# EasyEDA Pro project 割草机MCU.epro

# Schematic Schematic1
Create Date: 2024-04-23; Page Name: P1; Project Name: 飞协; Schematic Name: Schematic1; Update Date: 2024-04-27; Company: 嘉立创EDA; Page Size: A4; Version: V1.0
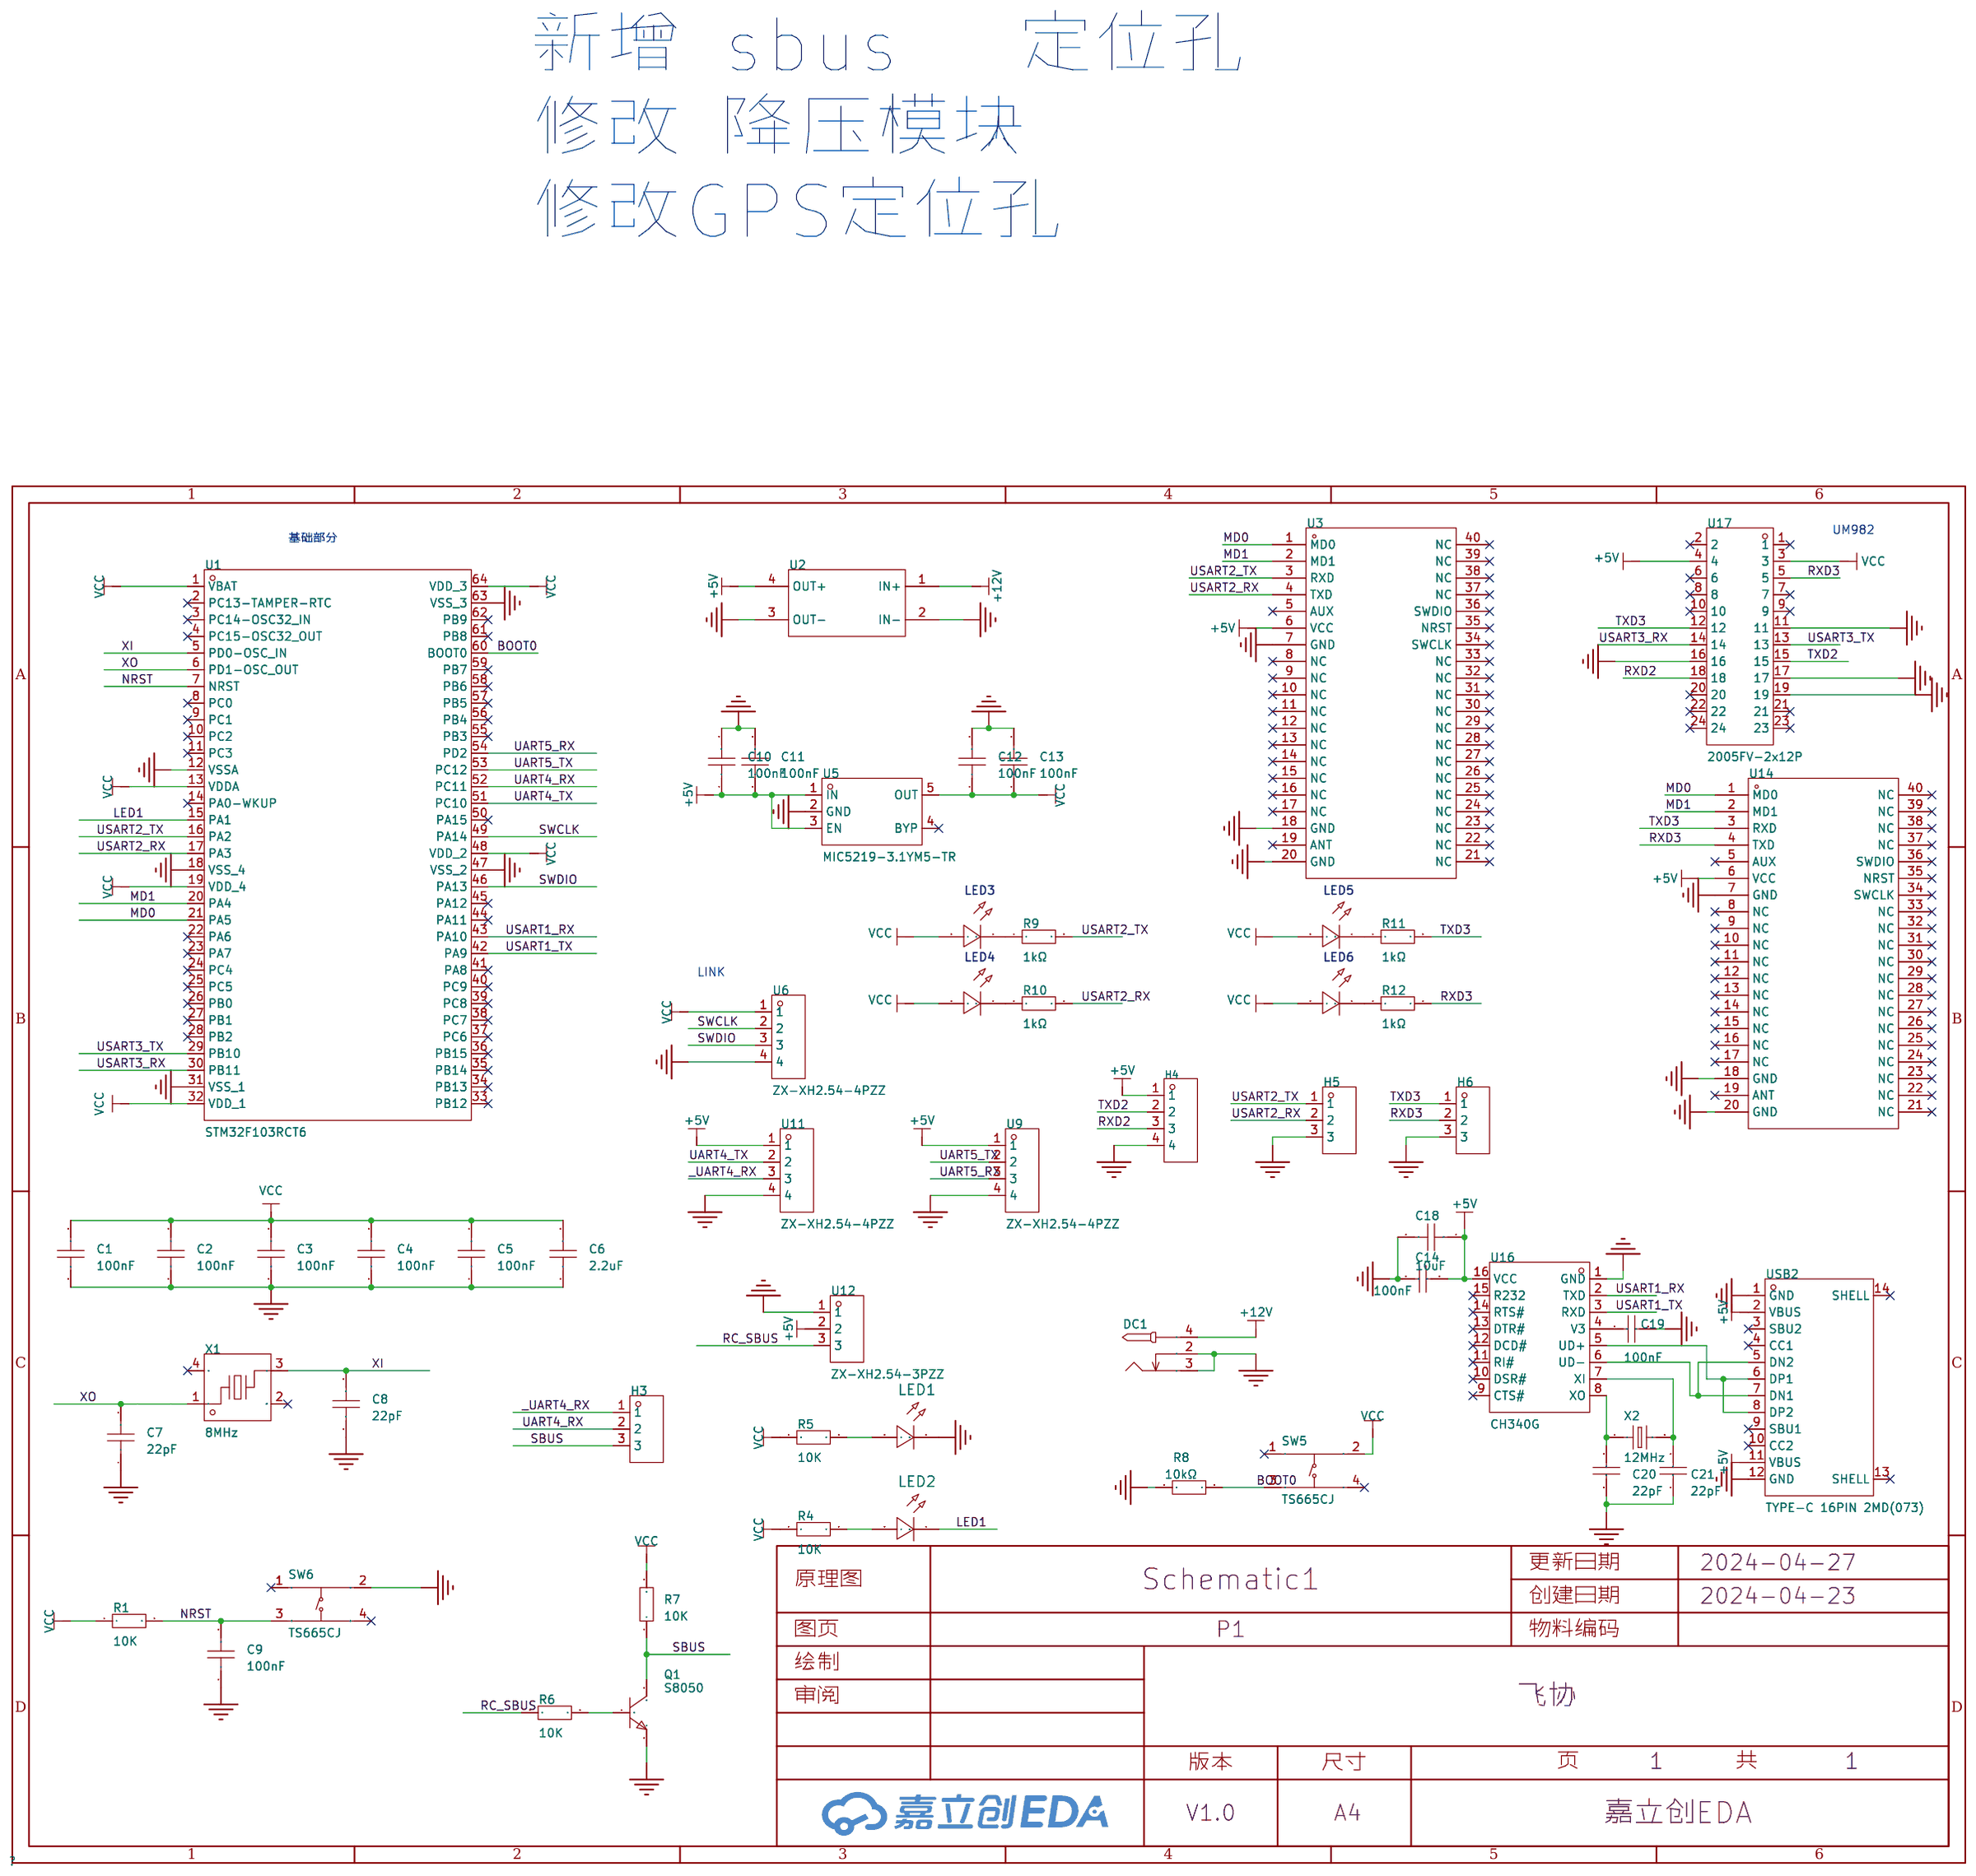
[diagram p0: schematic sheet]

## Parts
C1  100nF  [C0603]
C2  100nF  [C0603]
C3  100nF  [C0603]
C4  100nF  [C0603]
C5  100nF  [C0603]
C6  2.2uF  [C0603]
C7  22pF  [C0603]
C8  22pF  [C0603]
C9  100nF  [C0603]
C10  100nF  [C0603]
C11  100nF  [C0603]
C12  100nF  [C0603]
C13  100nF  [C0603]
C14  100nF  [C0603]
C18  10uF  [C0603]
C19  100nF  [C0603]
C20  22pF  [C0603]
C21  22pF  [C0603]
DC1  -  [DC-2.0]
H3  -  [HDR-TH_3P-P2.54-V-M]
H4  -  [HDR-TH_4P-P2.54-V-M]
H5  -  [HDR-TH_3P-P2.54-V-M]
H6  -  [HDR-TH_3P-P2.54-V-M]
LED1  -  [LED_0603]
LED2  -  [LED_0603]
LED3  -  [LED_0603]
LED4  -  [LED_0603]
LED5  -  [LED_0603]
LED6  -  [LED_0603]
Q1  S8050  [SOT-23-3_L2.9-W1.3-P1.90-LS2.4-BR]
R1  10K  [R0603]
R4  10K  [R0603]
R5  10K  [R0603]
R6  10K  [R0603]
R7  10K  [R0603]
R8  10kΩ  [R0603]
R9  1kΩ  [R0603]
R10  1kΩ  [R0603]
R11  1kΩ  [R0603]
R12  1kΩ  [R0603]
SW5  TS665CJ  [SW-TH_4P-L6.0-W6.0-P4.50-LS6.5]
SW6  TS665CJ  [SW-TH_4P-L6.0-W6.0-P4.50-LS6.5]
U1  STM32F103RCT6  [LQFP-64_L10.0-W10.0-P0.50-LS12.0-BL]
U2  -  [MP2482]
U3  -  [S26-PAD]
U5  MIC5219-3.1YM5-TR  [SOT-23-5_L2.9-W1.6-P0.95-LS2.8-BR]
U6  ZX-XH2.54-4PZZ  [CONN-TH_4P-P2.50_4PIN]
U9  ZX-XH2.54-4PZZ  [CONN-TH_4P-P2.50_4PIN]
U11  ZX-XH2.54-4PZZ  [CONN-TH_4P-P2.50_4PIN]
U12  ZX-XH2.54-3PZZ  [CONN-TH_3P-P2.54_2501S-3P]
U14  -  [S26-PAD]
U16  CH340G  [SOIC-16_L9.9-W3.9-P1.27-LS6.0-BL]
U17  2005FV-2x12P  [HDR-TH_24P-P2.00-V-F-R2-C12-S2.00]
USB2  TYPE-C 16PIN 2MD(073)  [USB-C-SMD_TYPE-C-6PIN-2MD-073]
X1  8MHz  [OSC-SMD_4P-L3.2-W2.5-BL]
X2  12MHz  [HC-49US_L11.5-W4.5-P4.88]

## Library data of the parts
C1-C13 = CAP_0603: Supplier Footprint: 0603
C14 C19 = 0603B104K500NT: 容值:100nF;精度:±10%;额定电压:50V;材质(温度系数):X7R;; LCSC Part Name: 100nF ±10% 50V; Supplier Part: C30926; Manufacturer: FH(风华); Supplier Footprint: 0603; JLCPCB Part Class: 扩展库; Datasheet: https://atta.szlcsc.com/upload/public/pdf/source/20200305/C486355_26A10D38EF8C2A5C37091D0039909270.pdf; Supplier: LCSC; Tolerance: ±10%; Voltage Rated: 50V; Temperature Coefficient: X7R
C18 = CL10A106MA8NRNC: 容值:10uF;精度:±20%;额定电压:25V;材质(温度系数):X5R;; LCSC Part Name: 10uF ±20% 25V; Supplier Part: C96446; Manufacturer: SAMSUNG(三星); Supplier Footprint: 0603; JLCPCB Part Class: 基础库; Datasheet: https://atta.szlcsc.com/upload/public/pdf/source/20160218/1457707763339.pdf; Supplier: LCSC; Tolerance: ±20%; Voltage Rated: 25V; Temperature Coefficient: X5R
C20 C21 = CC0603JRNPO9BN220: 容值:22pF;精度:±5%;额定电压:50V;材质(温度系数):NP0;; LCSC Part Name: 22pF ±5% 50V; Supplier Part: C105620; Manufacturer: YAGEO(国巨); Supplier Footprint: 0603; JLCPCB Part Class: 扩展库; Datasheet: https://atta.szlcsc.com/upload/public/pdf/source/20170505/1493957838062.pdf; Supplier: LCSC; Tolerance: ±5%; Voltage Rated: 50V; Temperature Coefficient: NP0
DC1 = DC-005_2.0: Supplier Footprint: 插件
H3 H5 H6 = HDR-M_2.54_1x3P: Supplier Part: C2937625; Supplier Footprint: 插件
H4 = HDR-M_2.54_1x4P: Supplier Part: C492403; Supplier Footprint: 插件
LED1 LED2 = LED_0603-R: Supplier Footprint: 0603
LED3-LED6 = LED_0603-B: Supplier Footprint: 0603
Q1 = S8050_C2891804: 晶体管类型:NPN;集电极电流(Ic):500mA;集射极击穿电压(Vceo):25V;功率(Pd):300mW;; LCSC Part Name: NPN 电流:500mA 耐压:25V; Supplier Part: C2891804; Manufacturer: YONGYUTAI(永裕泰); Supplier Footprint: SOT-23; JLCPCB Part Class: 扩展库; Datasheet: https://atta.szlcsc.com/upload/public/pdf/source/20210901/5347316A10609C628D4D69AE01446E5B.pdf; Supplier: LCSC; Transistor Type: NPN; Collector Current (Ic): 500mA; Collector-Emitter Breakdown Voltage (Vceo): 25V; Power Dissipation (Pd): 300mW; Collector Cut-Off Current (Icbo): 1uA; Collector-Emitter Saturation Voltage (VCE(sat)@Ic,Ib): 500mV@500mA,50mA
R1 R4-R7 = Res_0603: Supplier Footprint: 0603
R8 = RC0603FR-0710KL: 电阻类型:厚膜电阻;阻值:10kΩ;精度:±1%;功率:100mW;最大工作电压:75V;温度系数:±100ppm/℃;; LCSC Part Name: 厚膜电阻 10kΩ ±1% 100mW; Supplier Part: C98220; Manufacturer: YAGEO(国巨); Supplier Footprint: 0603; JLCPCB Part Class: 扩展库; Datasheet: https://atta.szlcsc.com/upload/public/pdf/source/20180927/C295883_E8D83085EA81BD7DE0B2B681138C15EE.pdf; Supplier: LCSC; Type: 厚膜电阻; Tolerance: ±1%; Power(Watts): 100mW; Overload Voltage (Max): 75V; Temperature Coefficient: ±100ppm/℃; Operating Temperature Range: -55℃~+155℃
R9-R12 = RC0603FR-071KL: 电阻类型:厚膜电阻;阻值:1kΩ;精度:±1%;功率:100mW;; LCSC Part Name: 1kΩ ±1% 100mW; Supplier Part: C22548; Manufacturer: YAGEO(国巨); Supplier Footprint: 0603; JLCPCB Part Class: 扩展库; Datasheet: https://atta.szlcsc.com/upload/public/pdf/source/20180312/7BD3618A8B6324EA6280B0497A051AB7.pdf; Supplier: LCSC; Type: 厚膜电阻; Tolerance: ±1%; Power(Watts): 100mW; Temperature Coefficient: ±100ppm/℃; Overload Voltage (Max): 75V; Operating Temperature Range: -55℃~+155℃
SW5 SW6 = TS665CJ: 电路结构:单刀单掷;按钮形状:圆形按钮;安装方式:直插;开关长度:6mm;开关宽度:6mm;开关高度:5mm;触点电流:50mA;额定电压(DC):12V;带灯:-;机械寿命:-;; LCSC Part Name: 6*6*5mm 直插 轻触开关; Supplier Part: C393938; Manufacturer: SHOU HAN(首韩); Supplier Footprint: 插件; JLCPCB Part Class: 扩展库; Datasheet: https://atta.szlcsc.com/upload/public/pdf/source/20190521/C393938_BDABEAC600B4C55E200A80AA129B70BC.pdf; Supplier: LCSC; Circuit: 单刀单掷; Actuator Style: 圆形按钮; Mounting Style: 直插; Switch Length: 6mm; Switch Width: 6mm; Switch Height: 5mm; Contact Current: 50mA; Voltage Rating (DC): 12V
U1 = STM32F103RCT6: CPU内核:ARM Cortex-M3;CPU最大主频:72MHz;工作电压范围:2V~3.6V;程序存储容量:256KB;程序存储器类型:FLASH;RAM总容量:48KB;GPIO端口数量:51;; Supplier Part: C8323; Manufacturer: ST(意法半导体); Supplier Footprint: LQFP-64(10x10); JLCPCB Part Class: Extended Part; Datasheet: https://atta.szlcsc.com/upload/public/pdf/source/20180207/C88442_15179953708671359491.pdf; Supplier: LCSC; CPU Core: ARM Cortex-M3; CPU Maximum Speed: 72MHz; Operating Voltage Range: 2V~3.6V; Program Storage Size: 256KB; Program Memory Type: FLASH; RAM Size: 48KB; GPIO Ports Number: 51; ADC (Bit): 12bit; DAC (Bit): 12bit; Universal Serial Bus: 有; Peripheral/Function: DMA；片载温度传感器；PWM; Watchdog: 有; Infrared Data Association: 有; Low-Voltage Detect: 有; Direct Memory Access: 有; Internal Oscillator: 有; Operating Temperature Range: -40℃~+85℃
U2 = MP2482: 7-30V--5 V  5A
U3 U14 = S26
U5 = MIC5219-3.1YM5-TR: Supplier Part: C625858; Manufacturer: MICROCHIP(美国微芯); Supplier Footprint: SOT-23-5; JLCPCB Part Class: Extended Part; Datasheet: https://atta.szlcsc.com/upload/public/pdf/source/20220308/DA7E777F7B5E98A0CDCA690AA8ECE812.pdf; Supplier: LCSC
U6 U9 U11 = ZX-XH2.54-4PZZ: 插针结构:1x4P;间距:2.54mm;安装方式:直插;行距:-;总PIN数:4P;排数:1;每排PIN数:4;参考系列:XH;额定电流:3A;触头材质:黄铜;触头镀层:锡;工作温度范围:-25℃~+85℃;; LCSC Part Name: 1x4P 间距:2.54mm 直插 系列:XH; Supplier Part: C7429634; Manufacturer: Megastar(兆星); Supplier Footprint: 插件,P=2.54mm; JLCPCB Part Class: 扩展库; Datasheet: https://atta.szlcsc.com/upload/public/pdf/source/20230619/B529A2163E0159A644AB3383D208FB03.pdf; Supplier: LCSC; Pins Structure: 1x4P; Pitch: 2.54mm; Mounting Style: 直插; Number of Pins: 4P; Number of Rows: 1; Number of PINs Per Row: 4; Reference Series: XH; Current Rating (Max): 3A; Contact Material: 黄铜; Contact Plating: 锡; Operating Temperature Range: -25℃~+85℃
U12 = ZX-XH2.54-3PZZ: 插针结构:1x3P;间距:2.54mm;安装方式:直插;行距:-;总PIN数:3P;排数:1;每排PIN数:3;参考系列:XH;额定电流:3A;触头材质:黄铜;触头镀层:锡;工作温度范围:-25℃~+85℃;; LCSC Part Name: 1x3P 间距:2.54mm 直插 系列:XH; Supplier Part: C7429633; Manufacturer: Megastar(兆星); Supplier Footprint: 插件,P=2.54mm; JLCPCB Part Class: Extended Part; Datasheet: https://atta.szlcsc.com/upload/public/pdf/source/20230619/AE17037A2CFDBE8D9CBA775D61AD0A84.pdf; Supplier: LCSC; Pins Structure: 1x3P; Pitch: 2.54mm; Mounting Style: 直插; Number of Pins: 3P; Number of Rows: 1; Number of PINs Per Row: 3; Reference Series: XH; Current Rating (Max): 3A; Contact Material: 黄铜; Contact Plating: 锡; Operating Temperature Range: -25℃~+85℃
U16 = CH340G: 应用功能:收发器;接口协议:USB 2.0;数据速率:2Mbps;; LCSC Part Name: USB转串口芯片 CH340; Supplier Part: C14267; Manufacturer: WCH(南京沁恒); Supplier Footprint: SOP-16; JLCPCB Part Class: 扩展库; Datasheet: https://atta.szlcsc.com/upload/public/pdf/source/20230530/6E401E9554E9F5311886CC8B3F89B62E.pdf; Supplier: LCSC; Applications Function: 收发器; Protocol: USB 2.0; Supply Voltage: 3.3V；5V; Data Rate: 2Mbps
U17 = 2005FV-2x12P: 插孔结构:2x12P;间距:2mm;行距:2mm;圆孔/方孔:方孔;安装类型:直插;排数:双排;总孔位数:24P;额定电流:2A;插孔方向:顶部;塑高:4.3mm;工作温度范围:-40℃~+105℃;; LCSC Part Name: 间距:2mm 2x12P 直插; Supplier Part: C18722942; Manufacturer: HanElectricity(瀚源); Supplier Footprint: 插件,P=2mm; Datasheet: https://atta.szlcsc.com/upload/public/pdf/source/20231018/9BA4E9C113EE80D3F158358D6D419558.pdf; Supplier: LCSC; Holes Structure: 2x12P; Pitch: 2mm; Row Spacing: 2mm; Circular Hole / Square Hole: 方孔; Mounting Type: 直插; Number of Rows: 双排; Number of Holes: 24P; Current Rating (Max): 2A; Holes Direction: 顶部; Insulation Height: 4.3mm; Operating Temperature Range: -40℃~+105℃
USB2 = TYPE-C 16PIN 2MD(073): 连接器类型:Type-C;标准:-;公母:母;端口数量:1;触点数量:16P;安装方式:卧贴;额定电流 - 电源:5A;工作温度范围:-25℃~+85℃;; LCSC Part Name: Type-C 母 卧贴; Supplier Part: C2765186; Manufacturer: SHOU HAN(首韩); Supplier Footprint: SMD; JLCPCB Part Class: 扩展库; Datasheet: https://atta.szlcsc.com/upload/public/pdf/source/20211123/39B17C16241EAC15C5E277BDA434118E.pdf; Supplier: LCSC; Connector Type: Type-C; Gender: 母; Number of Ports: 1; Number of Contacts: 16P; Mounting Style: 卧贴; Current Rating - Power (Max): 5A; Operating Temperature Range: -25℃~+85℃
X1 = X32258MOB4SI: 晶振类型:贴片无源晶振;频率:8MHz;常温频差:±10ppm;负载电容:12pF;频率稳定度(全温):±30ppm;; LCSC Part Name: 8MHz ±10ppm 12pF; Supplier Part: C2682775; Manufacturer: YXC(扬兴晶振); Supplier Footprint: SMD3225-4P; JLCPCB Part Class: 扩展库; Datasheet: https://atta.szlcsc.com/upload/public/pdf/source/20210106/C2682774_0CD4FDA5D9DA3FBEEC23BD607A48E4B0.pdf; Supplier: LCSC; Crystal Type: 贴片无源晶振; Normal temperature Frequency Tolerance: ±10ppm; Load Capacitance: 12pF; Frequency Stability(Full temperature range): ±30ppm; Equivalent Series Resistance (ESR): 150Ω; Operating Temperature: -40℃~+85℃
X2 = TAXD12M2GLFBET2T: 晶振类型:直插晶振;频率:12MHz;常温频差:±30ppm;外接负载电容:20pF;频率稳定度(全温):±30ppm;; LCSC Part Name: 12MHz ±30ppm 20pF; Supplier Part: C127674; Manufacturer: YJX(雅晶鑫); Supplier Footprint: HC-49S; JLCPCB Part Class: 扩展库; Datasheet: https://atta.szlcsc.com/upload/public/pdf/source/20170914/C127676_1505359415156967690.pdf; Supplier: LCSC; Crystal Type: 直插晶振; Normal temperature Frequency Tolerance: ±30ppm; External load capacitor: 20pF; Frequency Stability(Full temperature range): ±30ppm; Equivalent Series Resistance (ESR): 50Ω; Operating Temperature: -20℃~+70℃

## Nets
+5V: C10.1 C11.1 C14.1 C18.1 H4.1 U2.4(OUT+) U3.6(VCC) U5.1(IN) U5.3(EN) U9.1 U11.1 U12.2 U14.6(VCC) U16.16(VCC) U17.4 USB2.2(VBUS) USB2.11(VBUS)
+12V: DC1.4 U2.1(IN+)
GND: C1.1 C2.1 C3.1 C4.1 C5.1 C6.1 C7.1 C8.1 C9.1 C10.2 C11.2 C12.2 C13.2 C14.2 C18.2 C19.1 C20.1 C21.1 DC1.2 DC1.3 H4.4 H5.3 H6.3 LED1.1(C) Q1.2(E) R8.1 SW6.2(B) U1.12(VSSA) U1.18(VSS_4) U1.31(VSS_1) U1.47(VSS_2) U1.63(VSS_3) U2.2(IN-) U2.3(OUT-) U3.7(GND) U3.18(GND) U3.20(GND) U5.2(GND) U6.4 U9.4 U11.4 U12.1 U14.7(GND) U14.18(GND) U14.20(GND) U16.1(GND) U17.11 U17.16 U17.17 U17.19 USB2.1(GND) USB2.12(GND)
VCC: C1.2 C2.2 C3.2 C4.2 C5.2 C6.2 C12.1 C13.1 LED3.2(A) LED4.2(A) LED5.2(A) LED6.2(A) R1.1 R4.1 R5.1 R7.2 SW5.2(B) U1.1(VBAT) U1.13(VDDA) U1.19(VDD_4) U1.32(VDD_1) U1.48(VDD_2) U1.64(VDD_3) U5.5(OUT) U6.1 U17.3
_UART4_RX: H3.1 U11.3
BOOT0: R8.2 SW5.3(C) U1.60(BOOT0)
LED1: LED2.1(C) U1.15(PA1)
MD0: U1.21(PA5) U3.1(MD0) U14.1(MD0)
MD1: U1.20(PA4) U3.2(MD1) U14.2(MD1)
NRST: C9.2 R1.2 SW6.3(C) U1.7(NRST)
RC_SBUS: R6.1 U12.3
RXD2: H4.3 U17.18
RXD3: H6.2 R12.2 U14.4(TXD) U17.5
SBUS: H3.3 Q1.3(C) R7.1
SWCLK: U1.49(PA14) U6.2
SWDIO: U1.46(PA13) U6.3
TXD2: H4.2 U17.15
TXD3: H6.1 R11.2 U14.3(RXD) U17.12
UART4_RX: H3.2 U1.52(PC11)
UART4_TX: U1.51(PC10) U11.2
UART5_RX: U1.54(PD2) U9.3
UART5_TX: U1.53(PC12) U9.2
USART1_RX: U1.43(PA10) U16.2(TXD)
USART1_TX: U1.42(PA9) U16.3(RXD)
USART2_RX: H5.2 R10.2 U1.17(PA3) U3.4(TXD)
USART2_TX: H5.1 R9.2 U1.16(PA2) U3.3(RXD)
USART3_RX: U1.30(PB11) U17.14
USART3_TX: U1.29(PB10) U17.13
XI: C8.2 U1.5(PD0-OSC_IN) X1.3
XO: C7.2 U1.6(PD1-OSC_OUT) X1.1
$1N8695: LED1.2(A) R5.2
$1N8698: LED2.2(A) R4.2
$1N12056: Q1.1(B) R6.2
$1N22229: U16.6(UD-) USB2.5(DN2) USB2.7(DN1)
$1N22241: U16.5(UD+) USB2.6(DP1) USB2.8(DP2)
$1N24568: C20.2 U16.8(XO) X2.1
$1N24572: C21.2 U16.7(XI) X2.2
$1N29838: C19.2 U16.4(V3)
$1N36299: LED3.1(C) R9.1
$1N36379: LED4.1(C) R10.1
$1N36529: LED5.1(C) R11.1
$1N36536: LED6.1(C) R12.1

Not connected (* = marked no-connect by the designer): SW5 1(A)* 4(D)*; SW6 1(A)* 4(D)*; U1 2(PC13-TAMPER-RTC)* 3(PC14-OSC32_IN)* 4(PC15-OSC32_OUT)* 8(PC0)* 9(PC1)* 10(PC2)* 11(PC3)* 14(PA0-WKUP)* 22(PA6)* 23(PA7)* 24(PC4)* 25(PC5)* 26(PB0)* 27(PB1)* 28(PB2)* 33(PB12)* 34(PB13)* 35(PB14)* 36(PB15)* 37(PC6)* 38(PC7)* 39(PC8)* 40(PC9)* 41(PA8)* 44(PA11)* 45(PA12)* 50(PA15)* 55(PB3)* 56(PB4)* 57(PB5)* 58(PB6)* 59(PB7)* 61(PB8)* 62(PB9)*; U3 5(AUX)* 8(NC)* 9(NC)* 10(NC)* 11(NC)* 12(NC)* 13(NC)* 14(NC)* 15(NC)* 16(NC)* 17(NC)* 19(ANT)* 21(NC)* 22(NC)* 23(NC)* 24(NC)* 25(NC)* 26(NC)* 27(NC)* 28(NC)* 29(NC)* 30(NC)* 31(NC)* 32(NC)* 33(NC)* 34(SWCLK)* 35(NRST)* 36(SWDIO)* 37(NC)* 38(NC)* 39(NC)* 40(NC)*; U5 4(BYP)*; U14 5(AUX)* 8(NC)* 9(NC)* 10(NC)* 11(NC)* 12(NC)* 13(NC)* 14(NC)* 15(NC)* 16(NC)* 17(NC)* 19(ANT)* 21(NC)* 22(NC)* 23(NC)* 24(NC)* 25(NC)* 26(NC)* 27(NC)* 28(NC)* 29(NC)* 30(NC)* 31(NC)* 32(NC)* 33(NC)* 34(SWCLK)* 35(NRST)* 36(SWDIO)* 37(NC)* 38(NC)* 39(NC)* 40(NC)*; U16 9(CTS#)* 10(DSR#)* 11(RI#)* 12(DCD#)* 13(DTR#)* 14(RTS#)* 15(R232)*; U17 1* 2* 6* 7* 8* 9* 10* 20* 21* 22* 23* 24*; USB2 3(SBU2)* 4(CC1)* 9(SBU1)* 10(CC2)* 13(SHELL)* 14(SHELL)*; X1 2(GND)* 4(GND)*

## Notes on the sheet
- 新增 sbus   定位孔
  修改 降压模块
  修改GPS定位孔
- 基础部分
- UM982
- LINK

# Board PCB1
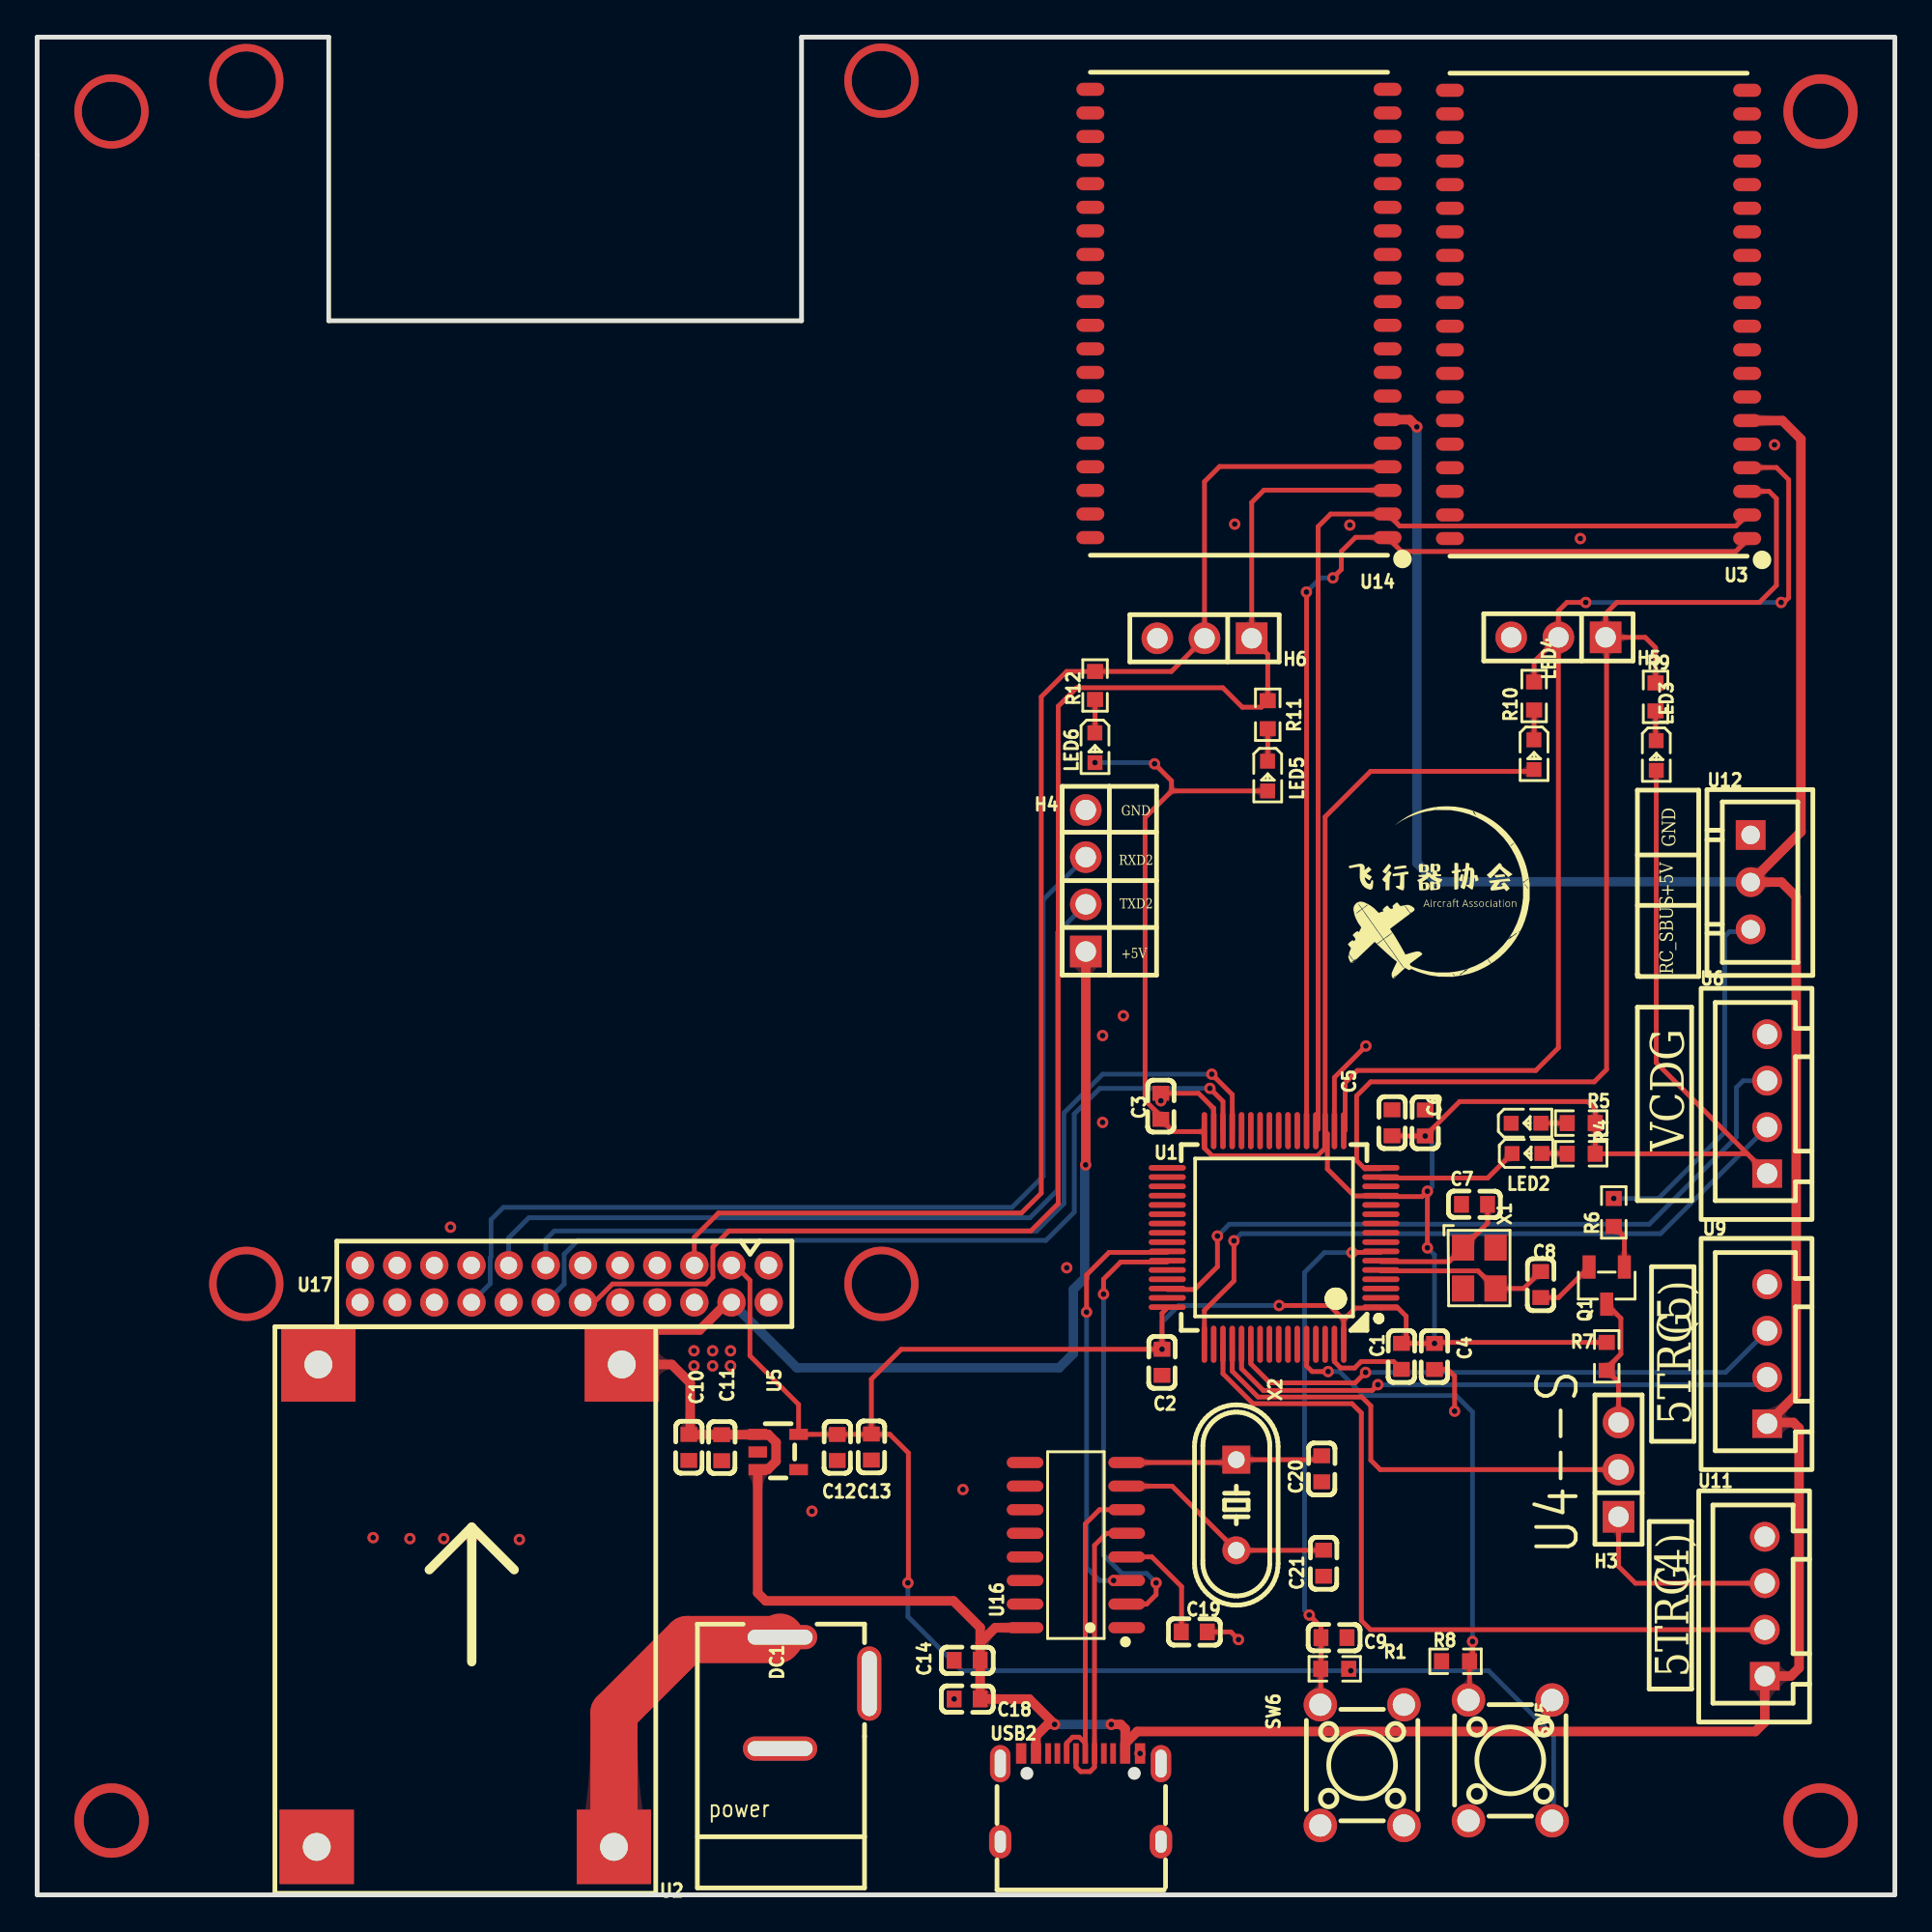
[diagram p1: board, top side]
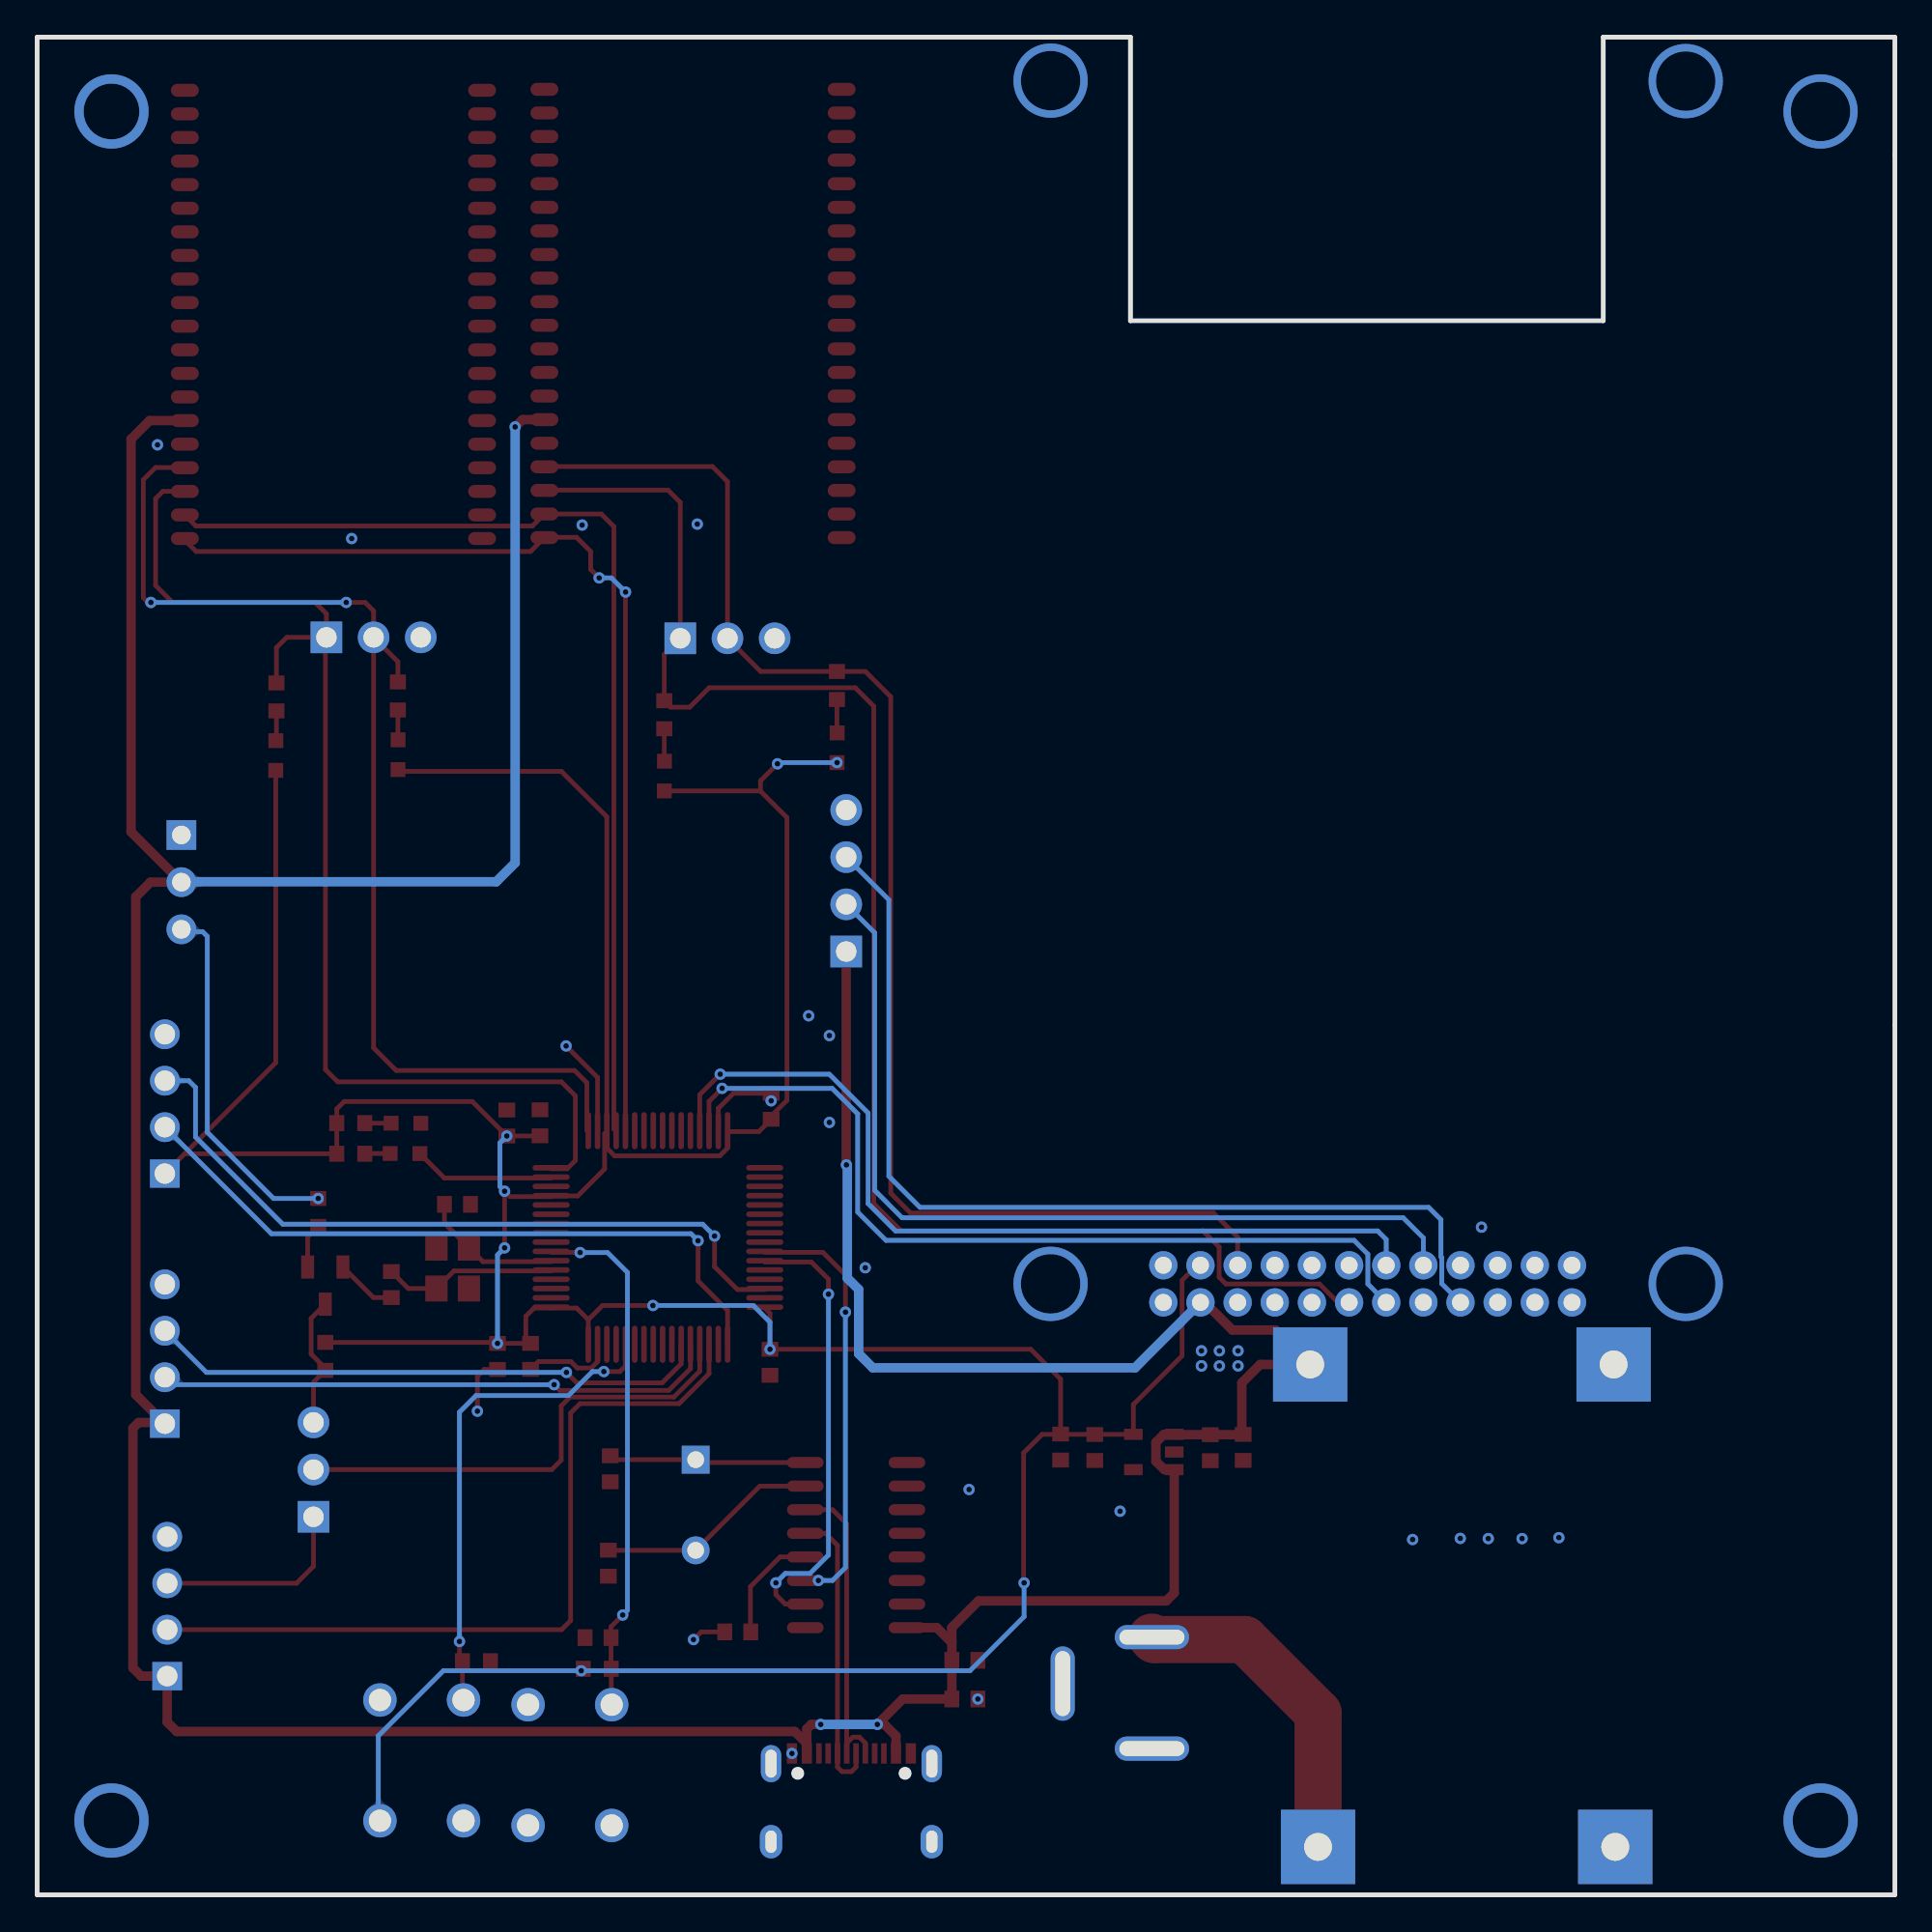
[diagram p2: board, bottom side, seen from below]

Outline 100 x 100 mm; copper layers: Top Layer, Bottom Layer. Coordinates in mm from the lower left corner of the outline.
Outline path: 0,100 15.7,100 15.7,84.73 41.15,84.73 41.15,100 100,100 100,0 0,0 0,100
Stack: Top Layer 0.035mm / Dielectric1 1.51mm FR4 er 4.5 / Bottom Layer 0.035mm

## Design rules (mm)
template: 自定义配置
spacing copperThickness1oz (default): track to track 0.102, other pairs 0.102 to 0.3
spacing copperThickness2oz: track to track 0.203, other pairs 0.152 to 0.3
track width copperThickness1oz (default): min 0.127, default 0.254, max 2.54
track width copperThickness2oz: min 0.203, default 0.254, max 2.54
differential pair differentialPair (default): width min 0.127, default 0.254, max 2.54; gap min 0.152, default 0.152
via viaSize (default): diameter min 0.5, default 0.61, max 10; hole min 0.3, default 0.305, max 6.299

## Placement (name value [footprint] x y rotation side)
C1  100nF  [C0603]  73.44 28.99 90 top
C2  100nF  [C0603]  60.55 28.67 90 top
C3  100nF  [C0603]  60.49 42.45 270 top
C4  100nF  [C0603]  75.22 28.98 90 top
C5  100nF  [C0603]  72.93 41.56 270 top
C6  2.2uF  [C0603]  74.72 41.55 270 top
C7  22pF  [C0603]  77.38 37.17 0 top
C8  22pF  [C0603]  80.93 32.85 90 top
C9  100nF  [C0603]  69.81 13.85 180 top
C10  100nF  [C0603]  35.08 24.09 270 top
C11  100nF  [C0603]  36.85 24.07 270 top
C12  100nF  [C0603]  43.07 24.08 270 top
C13  100nF  [C0603]  44.91 24.1 270 top
C14  100nF  [C0603]  50.06 12.62 180 top
C18  10uF  [C0603]  50.06 10.54 180 top
C19  100nF  [C0603]  62.29 14.15 180 top
C20  22pF  [C0603]  69.15 22.93 90 top
C21  22pF  [C0603]  69.25 17.85 90 top
DC1  -  [DC-2.0]  39.73 10.74 270 top
H3  -  [HDR-TH_3P-P2.54-V-M]  85.12 22.89 90 top
H4  -  [HDR-TH_4P-P2.54-V-M]  56.45 54.59 90 top
H5  -  [HDR-TH_3P-P2.54-V-M]  81.89 67.69 180 top
H6  -  [HDR-TH_3P-P2.54-V-M]  62.84 67.64 180 top
LED1  -  [LED_0603]  80.2 41.54 0 top
LED2  -  [LED_0603]  80.25 39.91 0 top
LED3  -  [LED_0603]  87.16 61.28 270 top
LED4  -  [LED_0603]  80.58 61.32 270 top
LED5  -  [LED_0603]  66.24 60.17 270 top
LED6  -  [LED_0603]  56.95 61.7 270 top
Q1  S8050  [SOT-23-3_L2.9-W1.3-P1.90-LS2.4-BR]  84.49 32.8 90 top
R1  10K  [R0603]  69.85 12.17 180 top
R4  10K  [R0603]  83.12 39.89 180 top
R5  10K  [R0603]  83.12 41.54 180 top
R6  10K  [R0603]  84.87 36.73 270 top
R7  10K  [R0603]  84.49 28.99 90 top
R8  10kΩ  [R0603]  76.35 12.57 0 top
R9  1kΩ  [R0603]  87.12 64.48 90 top
R10  1kΩ  [R0603]  80.58 64.53 90 top
R11  1kΩ  [R0603]  66.24 63.53 90 top
R12  1kΩ  [R0603]  56.95 65.1 90 top
SW5  TS665CJ  [SW-TH_4P-L6.0-W6.0-P4.50-LS6.5]  79.3 7.24 270 top
SW6  TS665CJ  [SW-TH_4P-L6.0-W6.0-P4.50-LS6.5]  71.32 6.99 270 top
U1  STM32F103RCT6  [LQFP-64_L10.0-W10.0-P0.50-LS12.0-BL]  66.58 35.39 90 top
U2  -  [MP2482]  33.38 30.71 180 top
U3  -  [S26-PAD]  92.05 72.06 90 top
U5  MIC5219-3.1YM5-TR  [SOT-23-5_L2.9-W1.6-P0.95-LS2.8-BR]  39.89 23.84 180 top
U6  ZX-XH2.54-4PZZ  [CONN-TH_4P-P2.50_4PIN]  93.13 42.58 90 top
U9  ZX-XH2.54-4PZZ  [CONN-TH_4P-P2.50_4PIN]  93.13 29.11 90 top
U11  ZX-XH2.54-4PZZ  [CONN-TH_4P-P2.50_4PIN]  93 15.52 90 top
U12  ZX-XH2.54-3PZZ  [CONN-TH_3P-P2.54_2501S-3P]  92.24 54.51 270 top
U14  -  [S26-PAD]  72.69 72.11 90 top
U16  CH340G  [SOIC-16_L9.9-W3.9-P1.27-LS6.0-BL]  55.91 18.83 90 top
U17  2005FV-2x12P  [HDR-TH_24P-P2.00-V-F-R2-C12-S2.00]  28.38 32.89 180 top
USB2  TYPE-C 16PIN 2MD(073)  [USB-C-SMD_TYPE-C-6PIN-2MD-073]  56.17 5.24 0 top
X1  8MHz  [OSC-SMD_4P-L3.2-W2.5-BL]  77.63 33.74 270 top
X2  12MHz  [HC-49US_L11.5-W4.5-P4.88]  64.55 20.99 270 top

## Footprints (pads in the part's own frame, mm; a bottom-side part is the same pattern mirrored in y, then rotated)
C0603
  rect 0.8x0.9 smd: 1(-0.7,0) 2(0.7,0)
CONN-TH_3P-P2.54_2501S-3P
  rect 1.6x1.6 hole 1: 1(-2.54,0)
  round 1.6 hole 1: 2(0,0) 3(2.54,0)
CONN-TH_4P-P2.50_4PIN
  rect 1.524x1.6 hole 1.1: 1(-3.75,0)
  round 1.6 hole 1.1: 2(-1.25,0) 3(1.25,0) 4(3.75,0)
DC-2.0
  oval 4x1.3 hole 3.5x0.8: 2(-0.627,5.067)
  oval 1.3x4 hole 0.8x3.5: 3(2.873,0.267) 4(-3.127,0.267)
HC-49US_L11.5-W4.5-P4.88
  rect 1.5x1.5 hole 0.9: 1(-2.44,0)
  round 1.5 hole 0.9: 2(2.44,0)
HDR-TH_3P-P2.54-V-M
  rect 1.7x1.7 hole 1.1: 1(-2.54,0)
  round 1.7 hole 1.1: 2(0,0) 3(2.54,0)
HDR-TH_4P-P2.54-V-M
  rect 1.7x1.7 hole 1.1: 1(-3.81,0)
  round 1.7 hole 1.1: 2(-1.27,0) 3(1.27,0) 4(3.81,0)
HDR-TH_24P-P2.00-V-F-R2-C12-S2.00
  round 1.524 hole 0.914: 1(-10.999,-1.001) 2(-10.999,0.998) 3(-9.001,-1.001) 4(-9.001,0.998) 5(-6.999,-1.001) 6(-6.999,0.998) 7(-5,-1.001) 8(-5,0.998) 9(-3.001,-1.001) 10(-3.001,1.001) 11(-1,-1.001) 12(-1,0.998) 13(1,-1.001) 14(1,0.998) 15(2.998,-1.001) 16(2.998,0.998) 17(4.997,-1.001) 18(4.997,0.998) 19(6.999,-1.001) 20(6.999,0.998) 21(9.001,-1.001) 22(8.998,0.998) 23(10.999,-1.001) 24(10.999,0.998)
LED_0603
  rect 0.8x0.8 smd: 1(-0.851,-0.01) 2(0.75,-0.005)
LQFP-64_L10.0-W10.0-P0.50-LS12.0-BL
  oval 0.3x2 smd: 1(-3.75,-5.75) 2(-3.25,-5.75) 3(-2.75,-5.75) 4(-2.25,-5.75) 5(-1.75,-5.75) 6(-1.25,-5.75) 7(-0.75,-5.75) 8(-0.25,-5.75) 9(0.25,-5.75) 10(0.75,-5.75) 11(1.25,-5.75) 12(1.75,-5.75) 13(2.25,-5.75) 14(2.75,-5.75) 15(3.25,-5.75) 16(3.75,-5.75) 33(3.75,5.75) 34(3.25,5.75) 35(2.75,5.75) 36(2.25,5.75) 37(1.75,5.75) 38(1.25,5.75) 39(0.75,5.75) 40(0.25,5.75) 41(-0.25,5.75) 42(-0.75,5.75) 43(-1.25,5.75) 44(-1.75,5.75) 45(-2.25,5.75) 46(-2.75,5.75) 47(-3.25,5.75) 48(-3.75,5.75)
  oval 2x0.3 smd: 17(5.75,-3.75) 18(5.75,-3.25) 19(5.75,-2.75) 20(5.75,-2.25) 21(5.75,-1.75) 22(5.75,-1.25) 23(5.75,-0.75) 24(5.75,-0.25) 25(5.75,0.25) 26(5.75,0.75) 27(5.75,1.25) 28(5.75,1.75) 29(5.75,2.25) 30(5.75,2.75) 31(5.75,3.25) 32(5.75,3.75) 49(-5.75,3.75) 50(-5.75,3.25) 51(-5.75,2.75) 52(-5.75,2.25) 53(-5.75,1.75) 54(-5.75,1.25) 55(-5.75,0.75) 56(-5.75,0.25) 57(-5.75,-0.25) 58(-5.75,-0.75) 59(-5.75,-1.25) 60(-5.75,-1.75) 61(-5.75,-2.25) 62(-5.75,-2.75) 63(-5.75,-3.25) 64(-5.75,-3.75)
MP2482
  rect 4x4 hole 1.5: 1(2.326,28.127) 2(18.326,28.127) 3(18.238,2.159) 4(1.905,2.159)
OSC-SMD_4P-L3.2-W2.5-BL
  rect 1.4x1.2 smd: 1(-1.1,-0.875) 2(1.1,-0.875) 3(1.1,0.875) 4(-1.1,0.875)
R0603
  rect 0.806x0.864 smd: 1(-0.753,0) 2(0.753,0)
S26-PAD
  oval 0.7x1.5 smd: 1(0.95,0) 2(2.22,0) 3(3.49,0) 4(4.76,0) 5(6.03,0) 6(7.3,0) 7(8.57,0) 8(9.84,0) 9(11.11,0) 10(12.38,0) 11(13.65,0) 12(14.92,0) 13(16.19,0) 14(17.46,0) 15(18.73,0) 16(20,0) 17(21.27,0) 18(22.54,0) 19(23.81,0) 20(25.08,0) 21(25.08,16) 22(23.81,16) 23(22.54,16) 24(21.27,16) 25(20,16) 26(18.73,16) 27(17.46,16) 28(16.19,16) 29(14.92,16) 30(13.65,16) 31(12.38,16) 32(11.11,16) 33(9.84,16) 34(8.57,16) 35(7.3,16) 36(6.03,16) 37(4.76,16) 38(3.49,16) 39(2.22,16) 40(0.95,16)
SOIC-16_L9.9-W3.9-P1.27-LS6.0-BL
  oval 0.602x1.971 smd: 1(-4.445,-2.736) 2(-3.175,-2.736) 3(-1.905,-2.736) 4(-0.635,-2.736) 5(0.635,-2.736) 6(1.905,-2.736) 7(3.175,-2.736) 8(4.445,-2.736) 9(4.445,2.736) 10(3.175,2.736) 11(1.905,2.736) 12(0.635,2.736) 13(-0.635,2.736) 14(-1.905,2.736) 15(-3.175,2.736) 16(-4.445,2.736)
SOT-23-3_L2.9-W1.3-P1.90-LS2.4-BR
  rect 1.25x0.7 smd: 1(1,-0.95) 2(1,0.95) 3(-1,0)
SOT-23-5_L2.9-W1.6-P0.95-LS2.8-BR
  rect 1x0.6 smd: 1(1.1,-0.95) 2(1.1,0) 3(1.1,0.95) 4(-1.1,0.95) 5(-1.1,-0.95)
SW-TH_4P-L6.0-W6.0-P4.50-LS6.5
  round 1.8 hole 1.2: 1(-3.25,2.25) 2(3.25,2.25) 3(-3.25,-2.25) 4(3.25,-2.25)
USB-C-SMD_TYPE-C-6PIN-2MD-073
  rect 0.55x1.1 smd: 1(-3.2,2.375) 2(-2.4,2.375) 11(2.4,2.375) 12(3.2,2.375)
  rect 0.3x1.1 smd: 3(-1.75,2.375) 4(-1.25,2.375) 5(-0.75,2.375) 6(-0.25,2.375) 7(0.25,2.375) 8(0.75,2.375) 9(1.25,2.375) 10(1.75,2.375)
  oval 1.1x2 hole 0.6x1.5: 13(-4.325,1.825) 14(4.325,1.825)
  oval 1.2x1.8 hole 0.6x1.2: 13(-4.325,-2.375) 14(4.325,-2.375)

## Nets
As in the schematic.

Pads without a net: SW5 1 4; SW6 1 4; U1 2 3 4 8 9 10 11 14 22 23 24 25 26 27 28 33 34 35 36 37 38 39 40 41 44 45 50 55 56 57 58 59 61 62; U3 5 8 9 10 11 12 13 14 15 16 17 19 21 22 23 24 25 26 27 28 29 30 31 32 33 34 35 36 37 38 39 40; U5 4; U14 5 8 9 10 11 12 13 14 15 16 17 19 21 22 23 24 25 26 27 28 29 30 31 32 33 34 35 36 37 38 39 40; U16 9 10 11 12 13 14 15; U17 1 2 6 7 8 9 10 20 21 22 23 24; USB2 3 4 9 10 13 14; X1 2 4

## Via types
v1: diameter 4, hole 3.2, Top Layer to Bottom Layer, 5 vias
v2: diameter 4, hole 3, Top Layer to Bottom Layer, 3 vias
v3: diameter 0.61, hole 0.305, Top Layer to Bottom Layer, 62 vias

## Routing (per net, layer and track width the routed paths; a pad name or vN(x,y) marks a point on that pad's centre or on a via; arc(x,y) is an arc through that point)
+5V: length 259.1
  Top Layer w0.508: 93.19,25.43 94.69,26.93 94.69,53.72 93.9,54.51 U12.2 94.94,57.22 94.94,78.36 93.94,79.36 U3.6 ; 93.19,25.43 U9.1 ; 93.19,25.43 94.54,25.43 94.84,25.12 94.84,12.22 94.4,11.77 U11.1 93,9.3 92.49,8.79 59.22,8.79 58.57,8.15 ; 50.76,13.57 50.76,14.39 49.33,15.82 39.22,15.82 38.79,16.25 38.79,22.89 39.32,22.89 39.78,23.34 39.78,24.36 39.35,24.79 38.79,24.79 38.77,24.77 35.09,24.77 C10.1 35.15,24.86 35.15,27.56 34.16,28.55 U2.4 33.32,30.4 35.66,30.4 37.15,31.89 37.38,31.89 ; 50.76,13.57 C14.1 C18.1 53.41,10.54 v3(54.77,9.17) 54.39,9.17 53.77,8.55 USB2.2 ; 50.76,13.57 51.57,14.38 U16.16 ; v3(74.27,79.02) 73.88,79.41 U14.6 ; 58.57,8.15 58.57,8.93 58.33,9.17 v3(57.82,9.17) ; 58.57,8.15 58.57,7.61 ; v3(56.44,39.29) 56.45,39.3 H4.1
  Bottom Layer w0.508: 37.38,31.89 40.9,28.37 55.02,28.37 55.78,29.13 55.78,32.59 56.39,33.2 56.39,39.24 v3(56.44,39.29) ; v3(74.27,79.02) 74.27,55.55 75.29,54.53 92.22,54.53 U12.2 ; v3(54.77,9.17) v3(57.82,9.17)
+12V: length 17.8
  Top Layer w2.54: U2.1 31.05,9.79 35,13.74 39.86,13.74 39.99,13.87
GND: length 23
  Top Layer w0.254: C1.1 73.02,28.71 71.27,28.71 70.92,28.36 70.18,28.36 69.83,28.7 69.83,29.59 ; C4.1 75.93,28.28 76.3,27.91 v3(76.3,26.03) ; C19.1 64.26,14.15 v3(64.67,13.74) ; C3.1 62.52,43.15 63.32,42.35 63.33,42.35 63.33,41.09 ; v3(71.53,45.69) 69.83,44 69.83,41.09 ; C8.1 81.9,32.15 Q1.2
  vias: v3(18.08,19.23) v3(20.07,19.18) v3(21.89,19.18) v3(22.25,35.94) v3(23.39,19.19) v3(25.96,19.13) v3(35.36,29.29) v3(35.36,28.47) v3(36.36,29.29) v3(36.36,28.47) v3(37.33,29.29) v3(37.33,28.47) v3(37.33,28.47) v3(41.71,20.65) v3(49.36,10.54) v3(49.84,21.82) v3(55.42,33.76) v3(57.35,46.25) v3(57.35,41.58) v3(58.47,47.32) v3(59.37,7.61) v3(60.49,42.74) v3(64.47,73.79) v3(70.66,73.74) v3(83.07,73.01) v3(93.52,78.05)
VCC: length 255
  Top Layer w0.254: 61.06,59.41 59.64,57.99 59.64,42.77 60.49,41.92 C3.2 61.15,41.09 62.83,41.09 62.83,40.2 63.25,39.78 68.91,39.78 69.33,40.2 69.33,41.09 69.45,40.97 69.45,39.07 70.9,37.62 72.3,37.62 72.33,37.59 74.55,37.59 v3(74.84,37.88) v3(74.84,34.83) ; 61.06,59.41 61.07,59.42 LED5.2 ; 61.06,59.41 61.06,59.97 v3(60.15,60.88) ; U17.3 37.56,33.89 38.37,33.08 38.37,29.02 40.99,26.4 U5.5 44.89,24.79 ; U1.19 69.33,58.03 71.78,60.48 80.48,60.48 LED4.2 ; 60.83,31.59 60.55,31.31 v3(60.55,29.37) 46.51,29.37 44.91,27.76 C13.1 44.89,24.79 ; 70.33,30.96 69.57,31.72 v3(66.85,31.72) ; 70.33,30.96 70.33,29.59 ; 70.33,30.96 70.96,31.59 73.25,31.59 73.69,31.15 73.69,29.94 C1.2 75.22,29.69 v3(75.22,29.68) 75.28,29.74 R7.2 ; 44.89,24.79 45.9,24.79 46.9,23.79 46.9,16.82 v3(46.87,16.79) ; LED3.2 87.16,44.79 92.06,39.89 ; 92.06,39.89 R4.1 R5.1 83.87,42.3 83.47,42.7 76.57,42.7 v3(74.72,40.85) 72.94,40.85 C5.2 ; 92.06,39.89 U6.1
  Top Layer w0.508: 43.06,24.79 C12.1
  Bottom Layer w0.254: 81.55,3.99 81.64,4.08 81.64,8.56 78.13,12.06 v3(70.71,12.06) 49.78,12.06 46.87,14.98 v3(46.87,16.79) ; v3(60.55,29.37) 60.55,30.83 61.45,31.72 v3(66.85,31.72) ; v3(74.84,34.83) 75.22,34.45 v3(75.22,29.68) ; v3(60.15,60.88) 60.08,60.95 v3(56.94,60.95) ; v3(74.84,37.88) 75.09,38.13 75.09,40.48 v3(74.72,40.85)
(no net):
  vias: v1(4,96) v1(11.26,97.63) v1(11.26,32.89) v1(45.45,97.66) v1(45.45,32.89) v2(4,4) v2(96,96) v2(96,4)
_UART4_RX: length 10.9
  Top Layer w0.254: U11.3 86.03,16.77 85.12,17.68 H3.1
BOOT0: length 26.7
  Top Layer w0.254: SW5.3 77.11,10.55 R8.2 77.27,12.73 v3(77.27,13.64) ; v3(69.49,28.17) 68.63,28.17 68.33,28.47 68.33,29.59
  Bottom Layer w0.254: v3(69.49,28.17) 70.1,28.17 71.39,26.88 76.37,26.88 77.27,25.98 v3(77.27,13.64)
LED1: length 7.6
  Top Layer w0.254: 72.33,38.59 78.08,38.59 LED2.1
MD0: length 55.2
  Top Layer w0.254: U3.1 92.05,72.92 91.44,72.31 73.44,72.31 U14.1 72.68,73.08 70.97,73.08 70.21,72.31 70.21,71.35 v3(69.75,70.89) ; U1.21 68.33,70.12 v3(68.33,70.13)
  Bottom Layer w0.254: v3(69.75,70.89) 69.09,70.89 v3(68.33,70.13)
MD1: length 56.3
  Top Layer w0.254: 68.95,41.21 68.95,73.65 69.63,74.33 U14.2 73.34,73.69 91.46,73.69 U3.2
NRST: length 28.2
  Top Layer w0.254: v3(70.77,34.57) 70.79,34.59 72.33,34.59 ; v3(68.48,15.06) 69.11,14.43 C9.2 69.11,12.18 R1.2 69.1,10.26 69.07,10.24
  Bottom Layer w0.254: v3(70.77,34.57) 69.3,34.57 68.22,33.5 68.22,15.32 v3(68.48,15.06)
RC_SBUS: length 19.5
  Bottom Layer w0.254: U12.3 92.11,51.85 91.09,51.85 90.84,51.59 90.84,41.05 87.28,37.49 v3(84.87,37.49)
RXD2: length 53.7
  Bottom Layer w0.254: H4.3 54.15,53.56 54.15,38.68 52.48,37.01 25.09,37.01 24.44,36.35 24.44,34.35 24.39,34.3 24.39,32.9 23.38,31.89
RXD3: length 76.6
  Top Layer w0.254: U14.4 72.68,76.89 63.65,76.89 62.84,76.07 H6.2 61.05,65.85 R12.2 55.41,65.85 54.05,64.49 54.05,37.77 52.98,36.7 36.68,36.7 35.38,35.4 U17.5
SBUS: length 7.3
  Top Layer w0.254: Q1.3 85.25,31.03 85.25,29.11 84.49,28.35 R7.1 85.12,27.6 H3.3
SWCLK: length 37.5
  Top Layer w0.254: v3(64.42,35.21) 64.42,33.05 62.83,31.46 62.83,29.59
  Bottom Layer w0.254: v3(64.42,35.21) 64.81,35.59 87.39,35.59 U6.2
SWDIO: length 39.5
  Top Layer w0.254: 60.83,32.59 62.31,32.59 63.53,33.81 v3(63.53,35.46)
  Bottom Layer w0.254: v3(63.53,35.46) 64.17,36.1 86.78,36.1 91.47,40.8 91.47,43.46 91.84,43.83 U6.3
TXD2: length 48.1
  Bottom Layer w0.254: U17.15 25.38,35.36 26.47,36.45 53.44,36.45 54.91,37.92 54.91,51.79 H4.2
TXD3: length 86.4
  Top Layer w0.254: 29.38,31.89 29.98,31.89 30.97,32.88 36.01,32.88 36.37,33.25 36.37,34.87 37.24,35.74 53.49,35.74 54.97,37.21 54.97,63.98 55.96,64.98 63.82,64.98 64.87,63.93 65.9,63.93 R11.2 66.24,66.78 H6.1 65.38,74.96 66.04,75.62 72.68,75.62 U14.3
UART4_RX: length 26.1
  Top Layer w0.254: 64.33,29.59 64.33,28.19 65.72,26.8 71.31,26.8 71.79,26.32 71.79,23.4 72.3,22.89 H3.2
UART4_TX: length 43
  Top Layer w0.254: 63.83,29.59 63.83,28.05 65.44,26.44 70.78,26.44 71.28,25.94 71.28,14.76 71.77,14.27 U11.2
UART5_RX: length 30.4
  Top Layer w0.254: v3(71.51,28.12) 70.95,27.56 66.36,27.56 65.33,28.59 65.33,29.59
  Bottom Layer w0.254: U9.3 90.89,28.12 v3(71.51,28.12)
UART5_TX: length 30.3
  Top Layer w0.254: 64.83,29.59 64.83,28.32 66,27.15 71.86,27.15 v3(72.17,27.46)
  Bottom Layer w0.254: U9.2 92.72,27.46 v3(72.17,27.46)
USART1_RX: length 24.5
  Top Layer w0.254: U16.2 59.72,15.65 60.23,16.16 v3(60.23,16.79) ; v3(57.4,32.33) 57.4,33.14 58.33,34.07 60.81,34.07 60.83,34.09
  Bottom Layer w0.254: v3(60.23,16.79) 59.72,17.3 58.39,17.3 57.4,18.29 v3(57.4,32.33)
USART1_TX: length 23.1
  Top Layer w0.254: v3(57.95,16.92) U16.3 ; v3(56.49,31.37) 56.49,33.37 57.7,34.59 60.83,34.59
  Bottom Layer w0.254: v3(56.49,31.37) 56.49,17.62 57.19,16.92 v3(57.95,16.92)
USART2_RX: length 62.9
  Top Layer w0.254: v3(83.36,69.57) 82.35,69.57 81.89,69.11 H5.2 ; U3.4 92.06,76.83 93.62,76.83 94.28,76.17 94.28,69.83 94.03,69.57 v3(93.88,69.57) ; R10.2 80.58,66.38 H5.2 ; 70.33,41.09 70.41,41.16 70.41,43.71 71.07,44.37 80.67,44.37 81.89,45.59 H5.2
  Bottom Layer w0.254: v3(93.88,69.57) v3(83.36,69.57)
USART2_TX: length 64.6
  Top Layer w0.254: R9.2 87.12,67.14 86.56,67.69 H5.1 ; 72.33,39.09 71.47,39.09 71.03,39.53 71.03,43.01 71.78,43.76 83.82,43.76 84.48,44.42 84.48,67.64 H5.1 ; H5.1 84.43,68.96 85.04,69.57 92.71,69.57 93.62,70.48 93.62,75.16 93.23,75.55 U3.3
USART3_RX: length 47.2
  Top Layer w0.254: v3(63.13,43.41) 63.83,42.71 63.83,41.09
  Bottom Layer w0.254: v3(63.13,43.41) 57.21,43.41 55.83,42.04 55.83,36.75 54.31,35.23 29.11,35.23 28.37,34.49 28.37,32.88 27.38,31.89
USART3_TX: length 47.3
  Top Layer w0.254: v3(63.23,44.18) 64.33,43.07 64.33,41.09
  Bottom Layer w0.254: U17.13 27.38,33.89 27.38,35.28 27.84,35.74 53.8,35.74 55.27,37.21 55.27,42.09 57.36,44.18 v3(63.23,44.18)
XI: length 9.4
  Top Layer w0.254: 72.33,33.59 77.56,33.59 X1.3 80.02,32.64 C8.2
XO: length 7.6
  Top Layer w0.254: C7.2 78.08,36.16 X1.1 76,34.09 72.33,34.09
$1N8695: length 1.4
  Top Layer w0.254: LED1.2 82.36,41.54 82.37,41.54
$1N8698: length 1.4
  Top Layer w0.254: LED2.2 82.35,39.91 82.37,39.89
$1N12056: length 2.4
  Top Layer w0.254: Q1.1 85.44,35.41 R6.2
$1N22229: length 17.3
  Top Layer w0.254: USB2.5 55.42,8.17 55.74,8.49 56.09,8.49 56.42,8.16 USB2.7 56.42,7.62 56.42,19.97 57.19,20.73 U16.6
$1N22241: length 15.9
  Top Layer w0.254: 55.92,7.61 55.92,6.88 56.17,6.63 56.68,6.63 56.92,6.88 56.92,18.81 57.57,19.46 U16.5
$1N24568: length 10.6
  Top Layer w0.254: C20.2 68.94,23.43 X2.1 64.4,23.27 U16.8
$1N24572: length 12
  Top Layer w0.254: C21.2 69.24,18.55 X2.2 61.09,22 U16.7
$1N29838: length 6.1
  Top Layer w0.254: C19.2 61.6,14.17 61.6,16.59 60,18.19 U16.4
$1N36299: length 1.6
  Top Layer w0.254: R9.1 87.12,62.16 LED3.1
$1N36379: length 1.6
  Top Layer w0.254: LED4.1 80.58,62.18 R10.1
$1N36529: length 1.8
  Top Layer w0.254: R11.1 66.24,61.03 LED5.1
$1N36536: length 1.8
  Top Layer w0.254: R12.1 56.95,62.56 LED6.1

## Copper pours and planes (outline as drawn; the poured copper is in the pictures)
GND on Top Layer: 51.41,100 99.77,100 99.87,100.1 101.04,98.93 101.04,1.4 96.01,-3.63 2.13,-3.63 -6.35,4.85 -6.35,33.15 -1.63,37.87 50.8,37.87 51.41,38.48 51.41,99.43 50.84,100 51.09,100.25 51.26,100.25 51.41,100.1
GND on Bottom Layer: 51.56,100.81 100.03,100.81 101.35,99.49 101.35,0.38 96.01,-4.95 2.84,-4.95 -2.18,0.08 -2.18,37.01 -0.86,38.33 51.26,38.33 51.56,38.63
(no net) on Top Layer: 7.19,99.92 51.26,99.92 51.26,37.94 7.19,37.94
(no net) on Bottom Layer: 7.21,99.9 51.28,99.9 51.28,37.92 7.21,37.92

Small or netless copper shapes (teardrops, artwork), in the pictures only: 184 on Top Layer, 37 on Bottom Layer

## Text on the board
Top Silkscreen Layer: power | U4--S | RXD2 | TXD2 | GND | +5V | RC_SBUS | VCDG | 5TRG | (4) | (5)
